# EAGLE design cubey_v3.1 (EAGLE 9.6.2)
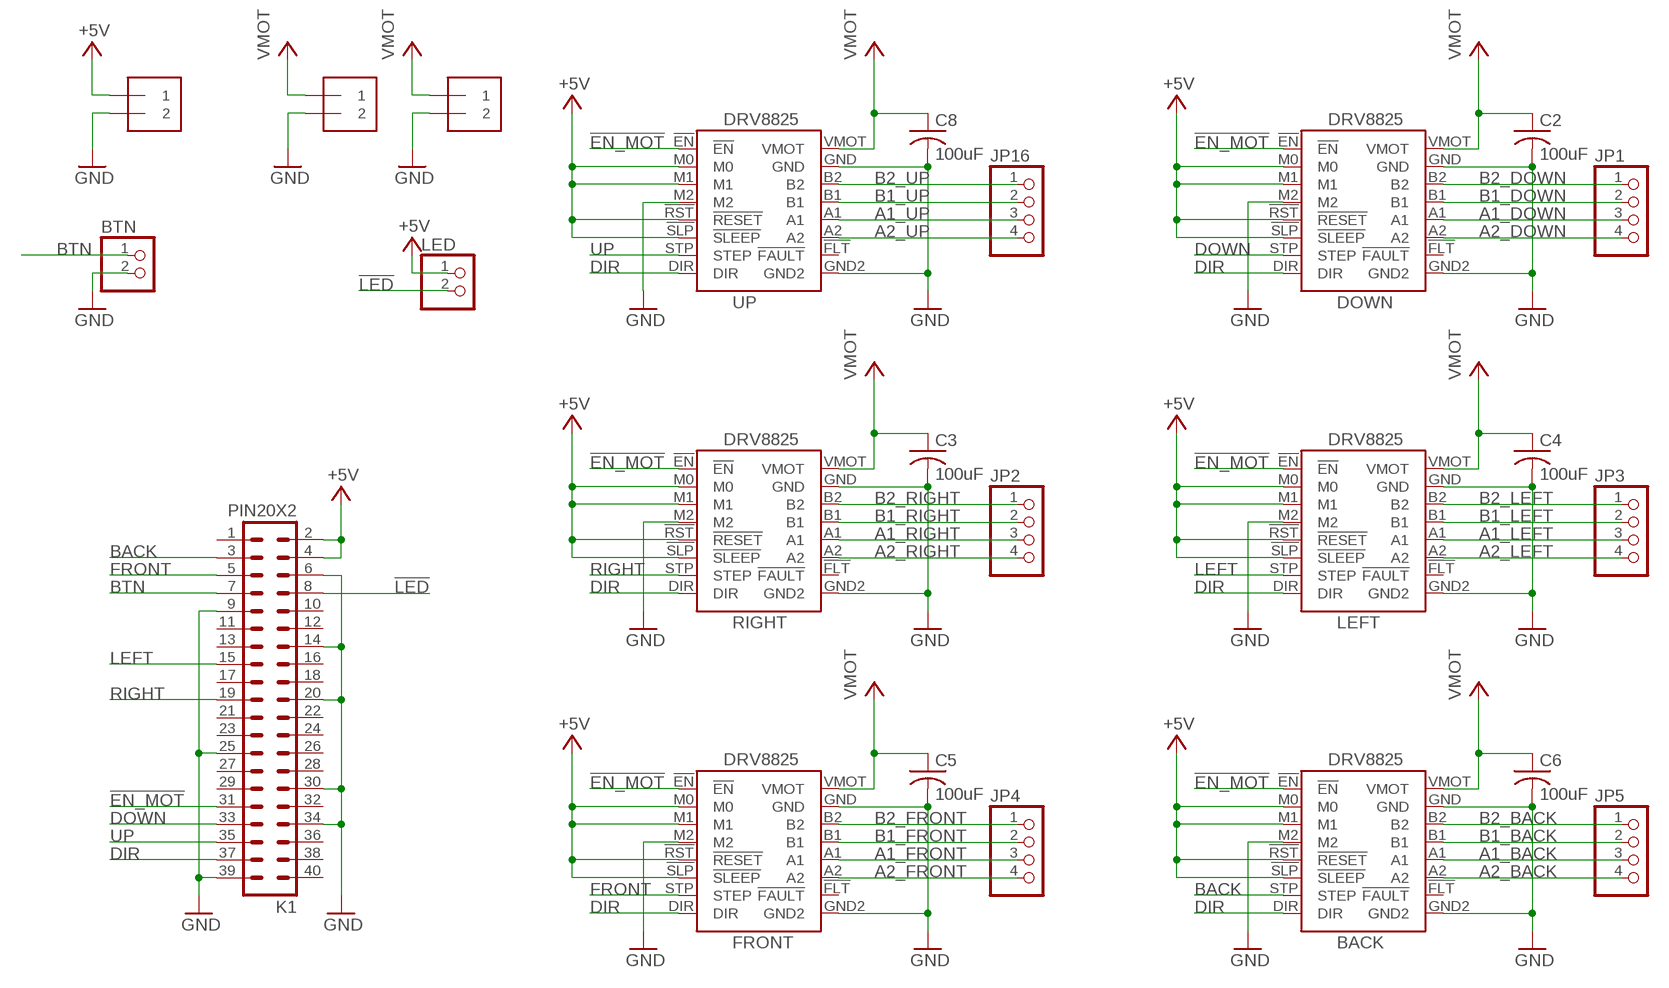
[diagram p0: schematic, sheet 1]

## Parts
5V_PWR  1X2-3.5MM  [1X2-3.5MM]
BACK  DRV_8825_SOCKET  [DRV_8825_DIP]
BTN  PINHD-1X2  [1X02]
C2  100uF  C-US025-025X050  [C025-025X050]
C3  100uF  C-US025-025X050  [C025-025X050]
C4  100uF  C-US025-025X050  [C025-025X050]
C5  100uF  C-US025-025X050  [C025-025X050]
C6  100uF  C-US025-025X050  [C025-025X050]
C8  100uF  C-US025-025X050  [C025-025X050]
DOWN  DRV_8825_SOCKET  [DRV_8825_DIP]
FRONT  DRV_8825_SOCKET  [DRV_8825_DIP]
JP1  PINHD-1X4  [1X04]
JP2  PINHD-1X4  [1X04]
JP3  PINHD-1X4  [1X04]
JP4  PINHD-1X4  [1X04]
JP5  PINHD-1X4  [1X04]
JP16  PINHD-1X4  [1X04]
K1  PIN20X2  [PIN_20X2]
LED  PINHD-1X2  [1X02]
LEFT  DRV_8825_SOCKET  [DRV_8825_DIP]
MOT_PWR  1X2-3.5MM  [1X2-3.5MM]
MOT_PWR1  1X2-3.5MM  [1X2-3.5MM]
RIGHT  DRV_8825_SOCKET  [DRV_8825_DIP]
UP  DRV_8825_SOCKET  [DRV_8825_DIP]

## Nets
!EN_MOT: BACK.!EN DOWN.!EN FRONT.!EN K1.31 LEFT.!EN RIGHT.!EN UP.!EN
!LED: K1.8 LED.2
+5V: 5V_PWR.1 BACK.!RST(!RESET) BACK.!SLP(!SLEEP) BACK.M0 BACK.M1 DOWN.!RST(!RESET) DOWN.!SLP(!SLEEP) DOWN.M0 DOWN.M1 FRONT.!RST(!RESET) FRONT.!SLP(!SLEEP) FRONT.M0 FRONT.M1 K1.2 K1.4 LED.1 LEFT.!RST(!RESET) LEFT.!SLP(!SLEEP) LEFT.M0 LEFT.M1 RIGHT.!RST(!RESET) RIGHT.!SLP(!SLEEP) RIGHT.M0 RIGHT.M1 UP.!RST(!RESET) UP.!SLP(!SLEEP) UP.M0 UP.M1
A1_BACK [VMOT]: BACK.A1 JP5.3
A1_DOWN [VMOT]: DOWN.A1 JP1.3
A1_FRONT [VMOT]: FRONT.A1 JP4.3
A1_LEFT [VMOT]: JP3.3 LEFT.A1
A1_RIGHT [VMOT]: JP2.3 RIGHT.A1
A1_UP [VMOT]: JP16.3 UP.A1
A2_BACK [VMOT]: BACK.A2 JP5.4
A2_DOWN [VMOT]: DOWN.A2 JP1.4
A2_FRONT [VMOT]: FRONT.A2 JP4.4
A2_LEFT [VMOT]: JP3.4 LEFT.A2
A2_RIGHT [VMOT]: JP2.4 RIGHT.A2
A2_UP [VMOT]: JP16.4 UP.A2
B1_BACK [VMOT]: BACK.B1 JP5.2
B1_DOWN [VMOT]: DOWN.B1 JP1.2
B1_FRONT [VMOT]: FRONT.B1 JP4.2
B1_LEFT [VMOT]: JP3.2 LEFT.B1
B1_RIGHT [VMOT]: JP2.2 RIGHT.B1
B1_UP [VMOT]: JP16.2 UP.B1
B2_BACK [VMOT]: BACK.B2 JP5.1
B2_DOWN [VMOT]: DOWN.B2 JP1.1
B2_FRONT [VMOT]: FRONT.B2 JP4.1
B2_LEFT [VMOT]: JP3.1 LEFT.B2
B2_RIGHT [VMOT]: JP2.1 RIGHT.B2
B2_UP [VMOT]: JP16.1 UP.B2
BACK: BACK.STP(STEP) K1.3
BTN: BTN.1 K1.7
DIR: BACK.DIR DOWN.DIR FRONT.DIR K1.37 LEFT.DIR RIGHT.DIR UP.DIR
DOWN: DOWN.STP(STEP) K1.33
FRONT: FRONT.STP(STEP) K1.5
GND [VMOT]: 5V_PWR.2 BACK.GND BACK.GND2 BACK.M2 BTN.2 C2.2 C3.2 C4.2 C5.2 C6.2 C8.2 DOWN.GND DOWN.GND2 DOWN.M2 FRONT.GND FRONT.GND2 FRONT.M2 K1.6 K1.9 K1.14 K1.20 K1.25 K1.30 K1.34 K1.39 LEFT.GND LEFT.GND2 LEFT.M2 MOT_PWR1.2 MOT_PWR.2 RIGHT.GND RIGHT.GND2 RIGHT.M2 UP.GND UP.GND2 UP.M2
LEFT: K1.15 LEFT.STP(STEP)
RIGHT: K1.19 RIGHT.STP(STEP)
UP: K1.35 UP.STP(STEP)
VMOT [VMOT]: BACK.VMOT C2.1 C3.1 C4.1 C5.1 C6.1 C8.1 DOWN.VMOT FRONT.VMOT LEFT.VMOT MOT_PWR1.1 MOT_PWR.1 RIGHT.VMOT UP.VMOT
Unconnected: BACK.!FLT(!FAULT) DOWN.!FLT(!FAULT) FRONT.!FLT(!FAULT) K1.1 K1.10 K1.11 K1.12 K1.13 K1.16 K1.17 K1.18 K1.21 K1.22 K1.23 K1.24 K1.26 K1.27 K1.28 K1.29 K1.32 K1.36 K1.38 K1.40 LEFT.!FLT(!FAULT) RIGHT.!FLT(!FAULT) UP.!FLT(!FAULT)

## Library data of the parts
5V_PWR MOT_PWR MOT_PWR1 = adafruit:1X2: 3.5mm Terminal block http://www.ladyada.net/library/pcb/eaglelibrary.html
BACK DOWN FRONT LEFT RIGHT UP = cubey:DRV_8825_SOCKET: DIP socket for DRV_8825 module from Pololu
BTN LED = pinhead:PINHD-1X2: PIN HEADER
C2-C6 C8 = rcl:C-US: CAPACITOR, American symbol; SPICEPREFIX: C
JP1-JP5 JP16 = pinhead:PINHD-1X4: PIN HEADER
K1 = FLYFISH:PIN20X2

## Net classes
0 default: width 0.406 mm, clearance 0.203 mm
1 VMOT: width 0.508 mm, clearance 0.254 mm to class 0

## Board
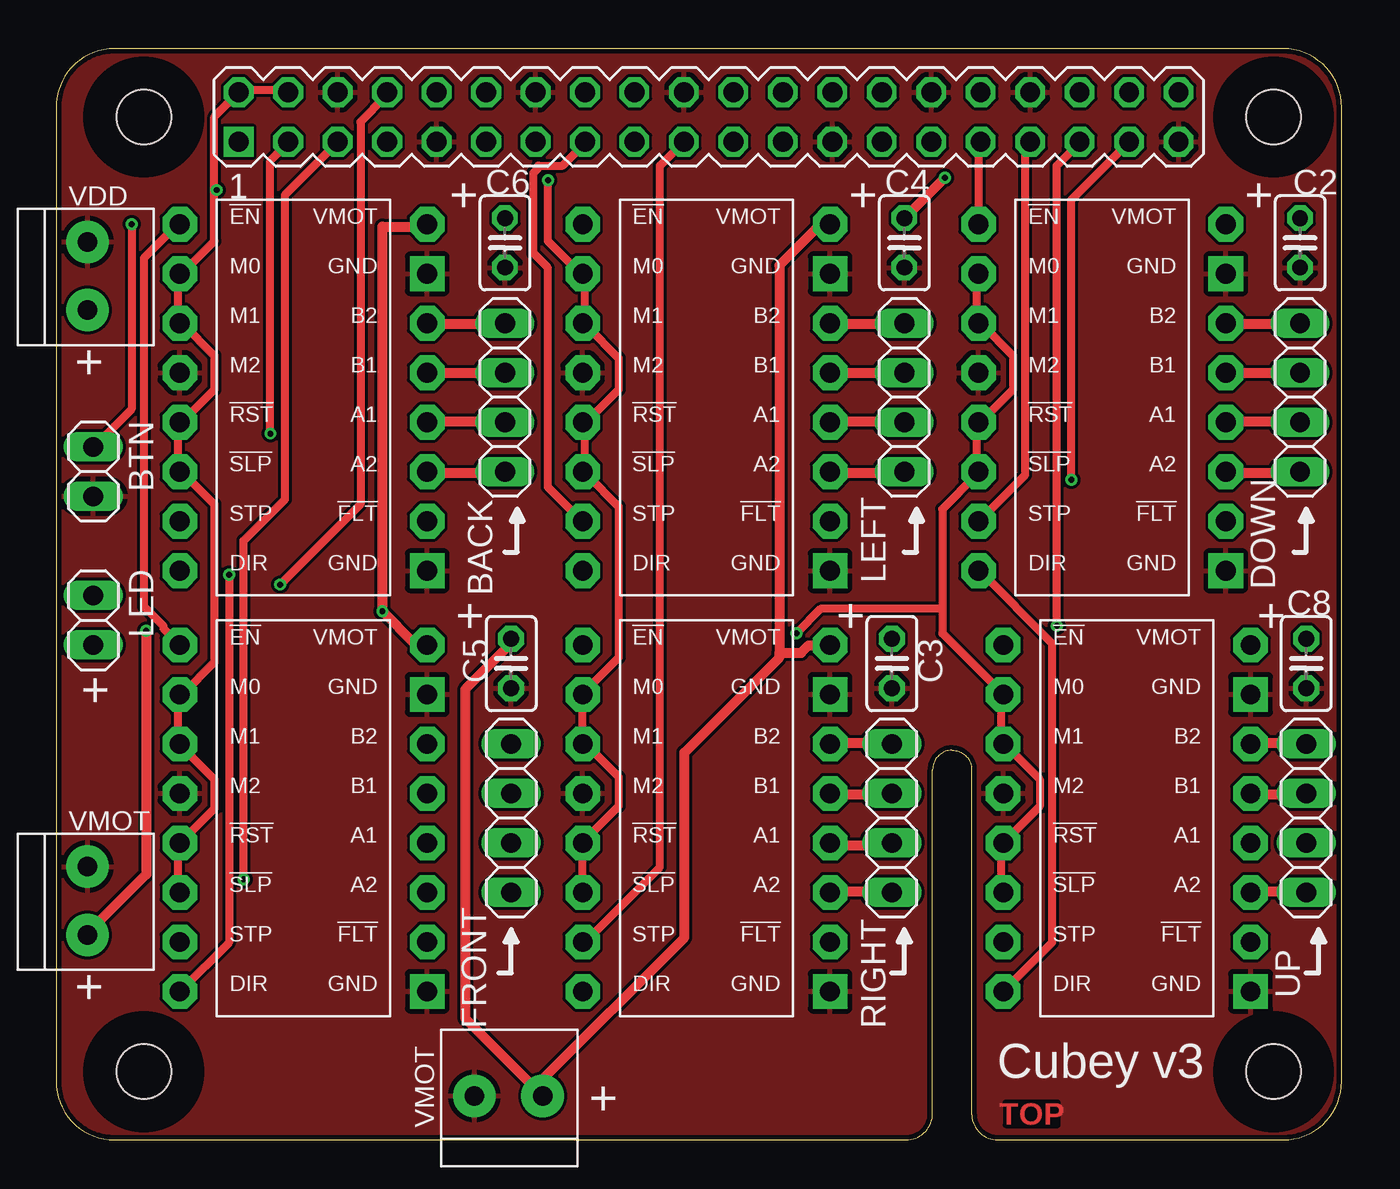
[diagram p1: board, top side]
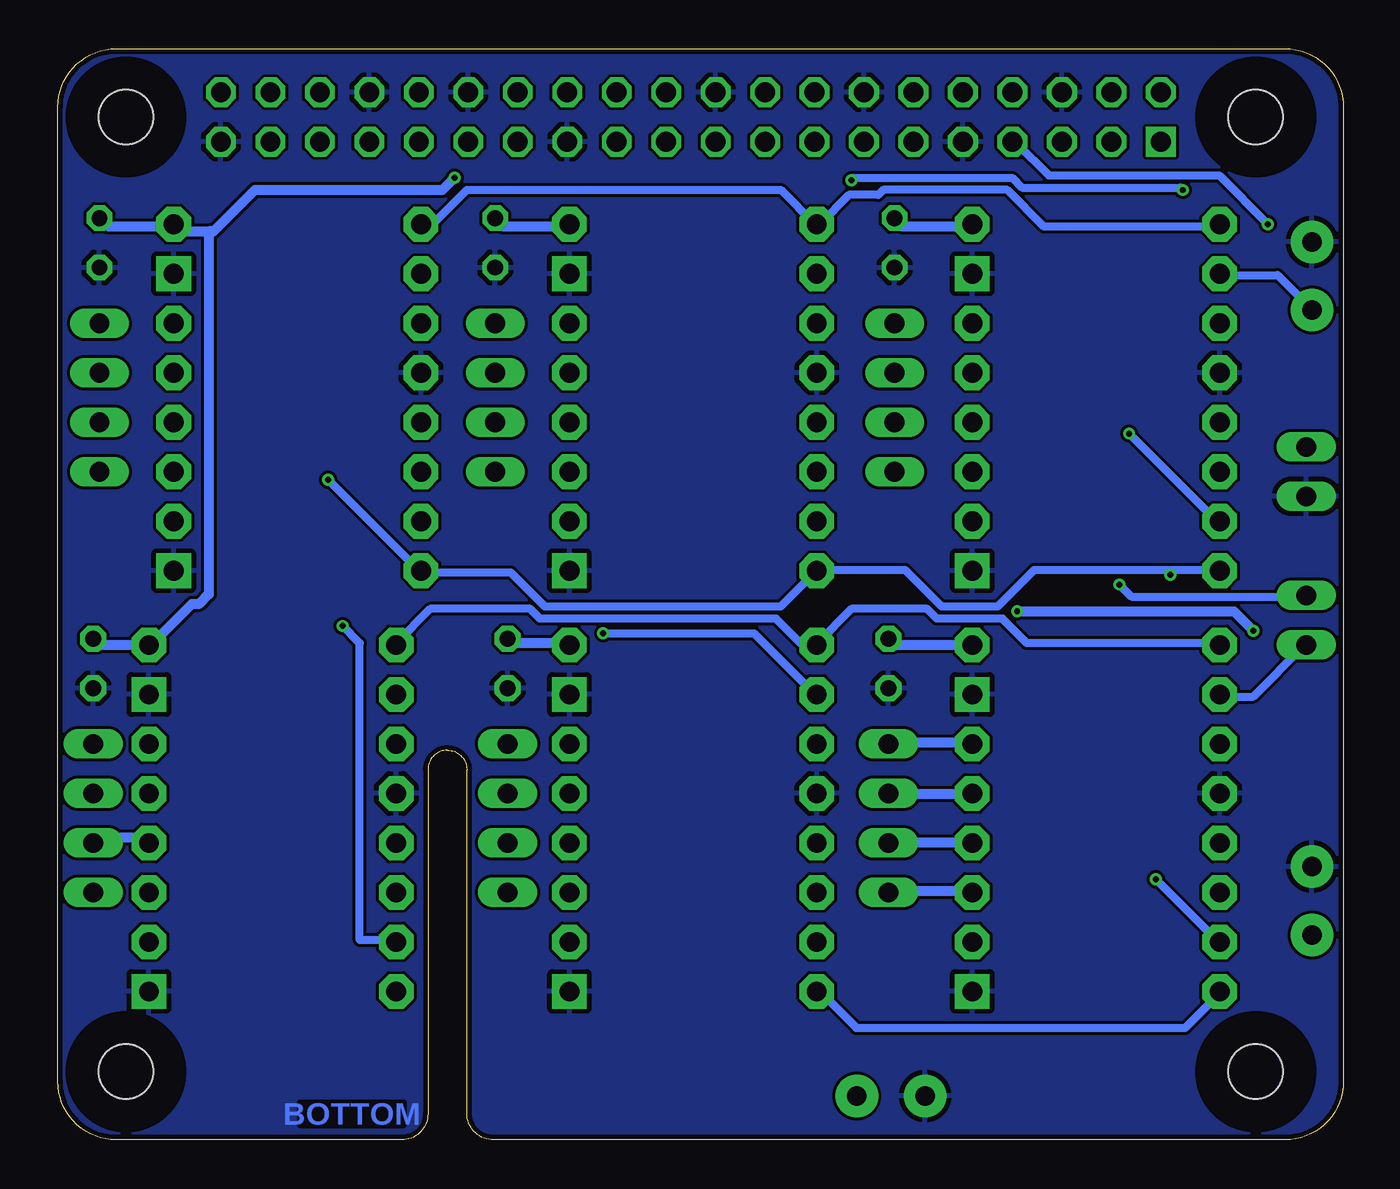
[diagram p2: board, bottom side, seen from below]

Size 66 x 56 mm. Coordinates in mm from the lower left corner, seen from the top.
Outline: 0,3 arc90 3,0 43.63,0 arc90 45,1.37 45,19 arc-90 46,20 arc-90 47,19 47,1.35 arc90 48.35,0 63,0 arc90 66,3 66,53 arc90 63,56 3,56 arc90 0,53 0,3
Copper layers (1*16): Top 0.035mm / dielectric 1.5mm / Bottom 0.035mm
Design rules "ITEADstudio_DRC": minimum track width 6mil, minimum drill 12mil, track to track 6mil, track to pad 6mil, pad to pad 6mil, via to via 6mil, smd to smd 0mil, copper to edge 10mil, drill to drill 10mil, minimum pad ring 10mil, minimum via ring 6mil, stop-mask expansion 2mil, vias tented up to drill 100mil, thermal gap 10mil
Holes 2.8 mm at 4.5,3.5 4.5,52.5 62.5,52.5 62.5,3.5
tRestrict: area 3,51 to 6,54; area 61,1.9 to 64,5; area 3,1.9 to 6,5; area 61,51 to 64,54
bRestrict: area 3,1.9 to 6,5; area 3,51 to 6,54; area 61,1.9 to 64,5; area 61,51 to 64,54

### Footprints (pad centres in the part's own frame; a part is rotated, then mirrored left to right if it is on the bottom)
1X2-3.5MM = drill 1 pad 2.184: 1 1.8,0; 2 -1.7,0
DRV_8825_DIP = drill 1.016 pad 1.778 octagon: !EN -7.62,10.16; !FLT 5.08,-5.08; !RST -7.62,0; !SLP -7.62,-2.54; A1 5.08,0; A2 5.08,-2.54; B1 5.08,2.54; B2 5.08,5.08; DIR -7.62,-7.62; M0 -7.62,7.62; M1 -7.62,5.08; M2 -7.62,2.54; STP -7.62,-5.08; VMOT 5.08,10.16 | drill 1.016 pad 1.778 square: GND 5.08,7.62; GND2 5.08,-7.62
1X02 = drill 1.016 long: 1 -1.27,0; 2 1.27,0
C025-025X050 = drill 0.813 octagon: 1 -1.27,0; 2 1.27,0
1X04 = drill 1.016 long: 1 -3.81,0; 2 -1.27,0; 3 1.27,0; 4 3.81,0
PIN_20X2 = drill 1.016 square: 1 -24.13,-1.27 | drill 1.016 octagon: 2 -24.13,1.27; 3 -21.59,-1.27; 4 -21.59,1.27; 5 -19.05,-1.27; 6 -19.05,1.27; 7 -16.51,-1.27; 8 -16.51,1.27; 9 -13.97,-1.27; 10 -13.97,1.27; 11 -11.43,-1.27; 12 -11.43,1.27; 13 -8.89,-1.27; 14 -8.89,1.27; 15 -6.35,-1.27; 16 -6.35,1.27; 17 -3.81,-1.27; 18 -3.81,1.27; 19 -1.27,-1.27; 20 -1.27,1.27; 21 1.27,-1.27; 22 1.27,1.27; 23 3.81,-1.27; 24 3.81,1.27; 25 6.35,-1.27; 26 6.35,1.27; 27 8.89,-1.27; 28 8.89,1.27; 29 11.43,-1.27; 30 11.43,1.27; 31 13.97,-1.27; 32 13.97,1.27; 33 16.51,-1.27; 34 16.51,1.27; 35 19.05,-1.27; 36 19.05,1.27; 37 21.59,-1.27; 38 21.59,1.27; 39 24.13,-1.27; 40 24.13,1.27

### Placement (x,y rotation side)
5V_PWR  1.62,44.39 270 top
BACK  13.97,36.83 0 top
BTN  1.91,34.29 270 top
C2  63.87,46.04 270 top
C3  42.91,24.45 270 top
C4  43.55,46.04 270 top
C5  23.36,24.45 270 top
C6  23.04,46.04 270 top
C8  64.18,24.45 270 top
DOWN  54.98,36.83 0 top
FRONT  13.97,15.24 0 top
JP1  63.87,38.1 270 top
JP2  42.91,16.51 270 top
JP3  43.55,38.1 270 top
JP4  23.36,16.51 270 top
JP5  23.04,38.1 270 top
JP16  64.18,16.51 270 top
K1  33.5,52.5 0 top
LED  1.91,26.67 90 top
LEFT  34.66,36.83 0 top
MOT_PWR  23.18,2.25 0 top
MOT_PWR1  1.62,12.32 270 top
RIGHT  34.66,15.24 0 top
UP  56.24,15.24 0 top

### Tracks (layer width: path | path; a pad name or v marks a point on that pad's centre or on a via)
!EN_MOT
  Top 0.406: K1.31 47.38,51.12 47.38,47 DOWN.!EN | FRONT.!EN 5.5,26.25 5.5,26.38 4.5,27.38 4.5,45.25 6.25,47 BACK.!EN
  Bottom 0.406: DOWN.!EN 47.25,47 46.75,47 45,48.75 28.88,48.75 27.12,47 LEFT.!EN 26.88,47 25.38,48.5 23.88,48.5 23.62,48.75 17.25,48.75 15.38,46.88 6.38,46.88 BACK.!EN | FRONT.!EN 6.38,25.5 16.25,25.5 17.5,26.75 20.88,26.75 21.38,27.25 25.25,27.25 27,25.5 RIGHT.!EN 27.12,25.5 27.88,25.5 29.12,26.75 41.25,26.75 41.75,27.25 46.88,27.25 48.62,25.5 UP.!EN
!LED  (via drill 0.3)
  Top 0.406: v11.5,28.5 15.62,32.62 15.62,52.25 16.88,53.5 16.88,53.75 K1.8
  Bottom 0.406: v11.5,28.5 10.88,27.88 2,27.88 LED.2
+5V  (via drill 0.3)
  Top 0.406: FRONT.!SLP 6.25,12.75 6.25,15.12 FRONT.!RST 6.5,15.38 8.12,17 8.12,18.5 6.5,20.12 6.5,20.25 FRONT.M1 6.25,20.38 6.25,22.75 FRONT.M0 6.5,22.88 8.12,24.5 8.12,32.62 6.5,34.25 BACK.!SLP 6.25,34.38 6.25,36.75 BACK.!RST 6.5,36.88 8.12,38.5 8.12,40.25 6.5,41.88 BACK.M1 6.25,42 6.25,44.38 BACK.M0 6.5,44.5 8.12,46.12 8.12,48.75 | K1.4 11.88,53.88 9.38,53.88 K1.2 9.25,53.62 8.12,52.5 8.12,48.75 | RIGHT.!SLP 27,12.75 27,15.12 RIGHT.!RST 27.12,15.38 28.88,17.12 28.88,18.62 27.12,20.38 RIGHT.M1 27,20.38 27,22.75 RIGHT.M0 27.12,23 28.88,24.75 28.88,32.5 27.25,34.12 27.25,34.25 LEFT.!SLP 27.12,34.38 27.12,36.75 LEFT.!RST 27.25,36.88 28.88,38.5 28.88,40.12 27.25,41.75 27.25,41.88 LEFT.M1 27.12,42 27.12,44.38 LEFT.M0 26.88,44.5 25.25,46.12 v25.25,49.25 | UP.!SLP 48.62,12.75 48.5,12.88 48.5,15 48.62,15.12 UP.!RST 48.75,15.38 50.5,17.12 50.5,18.5 48.75,20.25 UP.M1 48.62,20.38 48.5,20.5 48.5,22.62 48.62,22.75 UP.M0 48.5,23 45.5,26 45.5,27.25 | DOWN.M0 47.25,44.38 47.25,42 DOWN.M1 47.5,41.88 49.12,40.25 49.12,38.5 47.5,36.88 DOWN.!RST 47.25,36.75 47.25,34.38 DOWN.!SLP 47.25,34.12 45.5,32.38 45.5,27.25 | v38,26 39.25,27.25 45.5,27.25 | v8.25,48.75 8.12,48.75
  Bottom 0.406: LED.1 2,25.38 4.62,22.75 6.25,22.75 FRONT.M0 | 5V_PWR.1 1.62,42.62 3.38,44.38 6.25,44.38 BACK.M0 | v38,26 30.25,26 27.12,22.88 RIGHT.M0 | v8.25,48.75 8.38,48.88 16.5,48.88 17,49.38 25.12,49.38 v25.25,49.25
A1_BACK
  Top 0.508: JP5.3 23,36.88 19.12,36.88 BACK.A1
A1_DOWN
  Top 0.508: JP1.3 63.75,36.88 60.12,36.88 DOWN.A1
A1_FRONT
  Bottom 0.508: JP4.3 23.25,15.25 19.12,15.25 FRONT.A1
A1_LEFT
  Top 0.508: JP3.3 43.5,36.88 39.75,36.88 LEFT.A1
A1_RIGHT
  Top 0.508: JP2.3 42.88,15.12 39.75,15.12 RIGHT.A1
A1_UP
  Bottom 0.508: JP16.3 64.12,15.25 63.88,15.5 61.62,15.5 61.38,15.25 UP.A1
A2_BACK
  Top 0.508: JP5.4 23,34.25 19.12,34.25 BACK.A2
A2_DOWN
  Top 0.508: JP1.4 63.75,34.25 60.12,34.25 DOWN.A2
A2_FRONT
  Bottom 0.508: JP4.4 23.25,12.75 19.12,12.75 FRONT.A2
A2_LEFT
  Top 0.508: JP3.4 43.5,34.25 39.75,34.25 LEFT.A2
A2_RIGHT
  Top 0.508: JP2.4 42.88,12.75 39.75,12.75 RIGHT.A2
A2_UP
  Top 0.508: JP16.4 64.12,12.75 61.38,12.75 UP.A2
B1_BACK
  Top 0.508: JP5.2 23,39.38 19.12,39.38 BACK.B1
B1_DOWN
  Top 0.508: JP1.2 63.75,39.38 60.12,39.38 DOWN.B1
B1_FRONT
  Bottom 0.508: JP4.2 23.25,17.75 19.12,17.75 FRONT.B1
B1_LEFT
  Top 0.508: JP3.2 43.5,39.38 39.75,39.38 LEFT.B1
B1_RIGHT
  Top 0.508: JP2.2 42.88,17.75 39.75,17.75 RIGHT.B1
B1_UP
  Top 0.508: JP16.2 64.12,17.75 61.38,17.75 UP.B1
B2_BACK
  Top 0.508: JP5.1 23,41.88 19.12,41.88 BACK.B2
B2_DOWN
  Top 0.508: JP1.1 63.75,41.88 60.12,41.88 DOWN.B2
B2_FRONT
  Bottom 0.508: JP4.1 23.25,20.38 19.12,20.38 FRONT.B2
B2_LEFT
  Top 0.508: JP3.1 43.5,41.88 39.75,41.88 LEFT.B2
B2_RIGHT
  Top 0.508: JP2.1 42.88,20.38 39.75,20.38 RIGHT.B2
B2_UP
  Top 0.508: JP16.1 64.12,20.38 61.38,20.38 UP.B2
BACK  (via drill 0.3)
  Top 0.406: v11,36.25 11,50.25 11.88,51.12 K1.3
  Bottom 0.406: v11,36.25 6.5,31.75 BACK.STP
BTN  (via drill 0.3)
  Top 0.406: v3.88,47 3.88,37.5 2,35.62 BTN.1
  Bottom 0.406: v3.88,47 6.38,49.5 15.12,49.5 16.75,51.12 16.88,51.12 K1.7
DIR  (via drill 0.3)
  Top 0.406: v8.88,29 8.88,10.12 6.38,7.62 FRONT.DIR | v52.12,33.88 52.12,48.25 55,51.12 K1.37 | UP.DIR 51.12,10.12 51.12,25.5 47.38,29.25 DOWN.DIR
  Bottom 0.406: FRONT.DIR 6.38,7.5 8.12,5.75 25,5.75 26.75,7.5 27,7.5 RIGHT.DIR | 8.88,29.25 15.88,29.25 17.75,27.38 20.62,27.38 22.5,29.25 27,29.25 LEFT.DIR 27.12,29.12 28.88,27.38 41,27.38 42.75,29.12 47.25,29.12 DOWN.DIR 47.38,29.25 47.5,29.25 v52.12,33.88 | 8.88,29.25 6.38,29.25 BACK.DIR | v8.88,29 8.88,29.25
DOWN
  Top 0.406: K1.33 50,51.12 49.75,50.88 49.75,34.12 47.38,31.75 DOWN.STP
FRONT  (via drill 0.3)
  Top 0.406: v9.62,13.38 9.62,30.75 11.75,32.88 11.75,48.5 14.38,51.12 K1.5
  Bottom 0.406: v9.62,13.38 6.5,10.25 6.38,10.25 FRONT.STP
GND
  pour Top: -4.5,57.5 67.5,57.5 67.5,-1.5 -4.5,-1.5
  pour Bottom: 72,57.5 72,-1.5 -1.5,-1.5 -1.5,57.5
LEFT
  Top 0.406: K1.15 27.12,51.12 26,50 24.75,50 24.75,49.88 24.5,49.62 24.5,45.5 25.25,44.75 25.25,33.5 27,31.75 LEFT.STP
RIGHT
  Top 0.406: K1.19 31,50 31,14 27.12,10.12 RIGHT.STP
UP  (via drill 0.3)
  Top 0.406: v51.38,26.38 51.38,50 52.5,51.12 K1.35
  Bottom 0.406: v51.38,26.38 50.5,25.5 50.5,10.25 48.62,10.25 UP.STP
VMOT  (via drill 0.3)
  Top 0.508: 37.12,25 38.25,25 38.62,25.38 39.62,25.38 RIGHT.VMOT | 37.12,25 37.12,44.88 39.12,46.88 39.62,46.88 LEFT.VMOT | v45.62,49.38 43.62,47.38 C4.1 | v4.62,26.12 4.62,13.62 1.62,10.62 MOT_PWR1.1 | FRONT.VMOT 19,25.5 18.38,25.5 v16.75,27.12 16.75,46.88 19,46.88 BACK.VMOT | C5.1 23.25,25.62 23.25,25.38 21,23.12 21,6.25 24.88,2.38 MOT_PWR.1 24.75,2.75 24.75,2.88 32.25,10.38 32.25,19.88 37.12,24.75 37.12,25
  Bottom 0.508: C3.1 42.88,25.62 42.75,25.5 39.75,25.5 RIGHT.VMOT | C4.1 43.5,47.25 43.12,46.88 39.75,46.88 LEFT.VMOT | C8.1 64.12,25.62 63.88,25.38 61.38,25.38 UP.VMOT 61.12,25.5 59.12,27.5 58.75,27.5 58.25,28 58.25,46.62 | C2.1 63.75,47.25 63.38,46.88 60.12,46.88 DOWN.VMOT 60.12,46.62 58.25,46.62 | v45.62,49.38 46.25,48.75 55.88,48.75 58,46.62 58.25,46.62 | C6.1 23,47.25 22.62,46.88 19.12,46.88 BACK.VMOT | C5.1 23.25,25.62 23,25.38 19.12,25.38 FRONT.VMOT | v4.62,26.12 5.62,27.12 v16.75,27.12

### Text on the board
Top: TOP
Bottom: BOTTOM
tPlace: + | + | + | + | + | + | + | + | + | +
tNames: VDD | VMOT | Cubey v3 | VMOT